# EAGLE design sport mode (EAGLE 9.6.1)
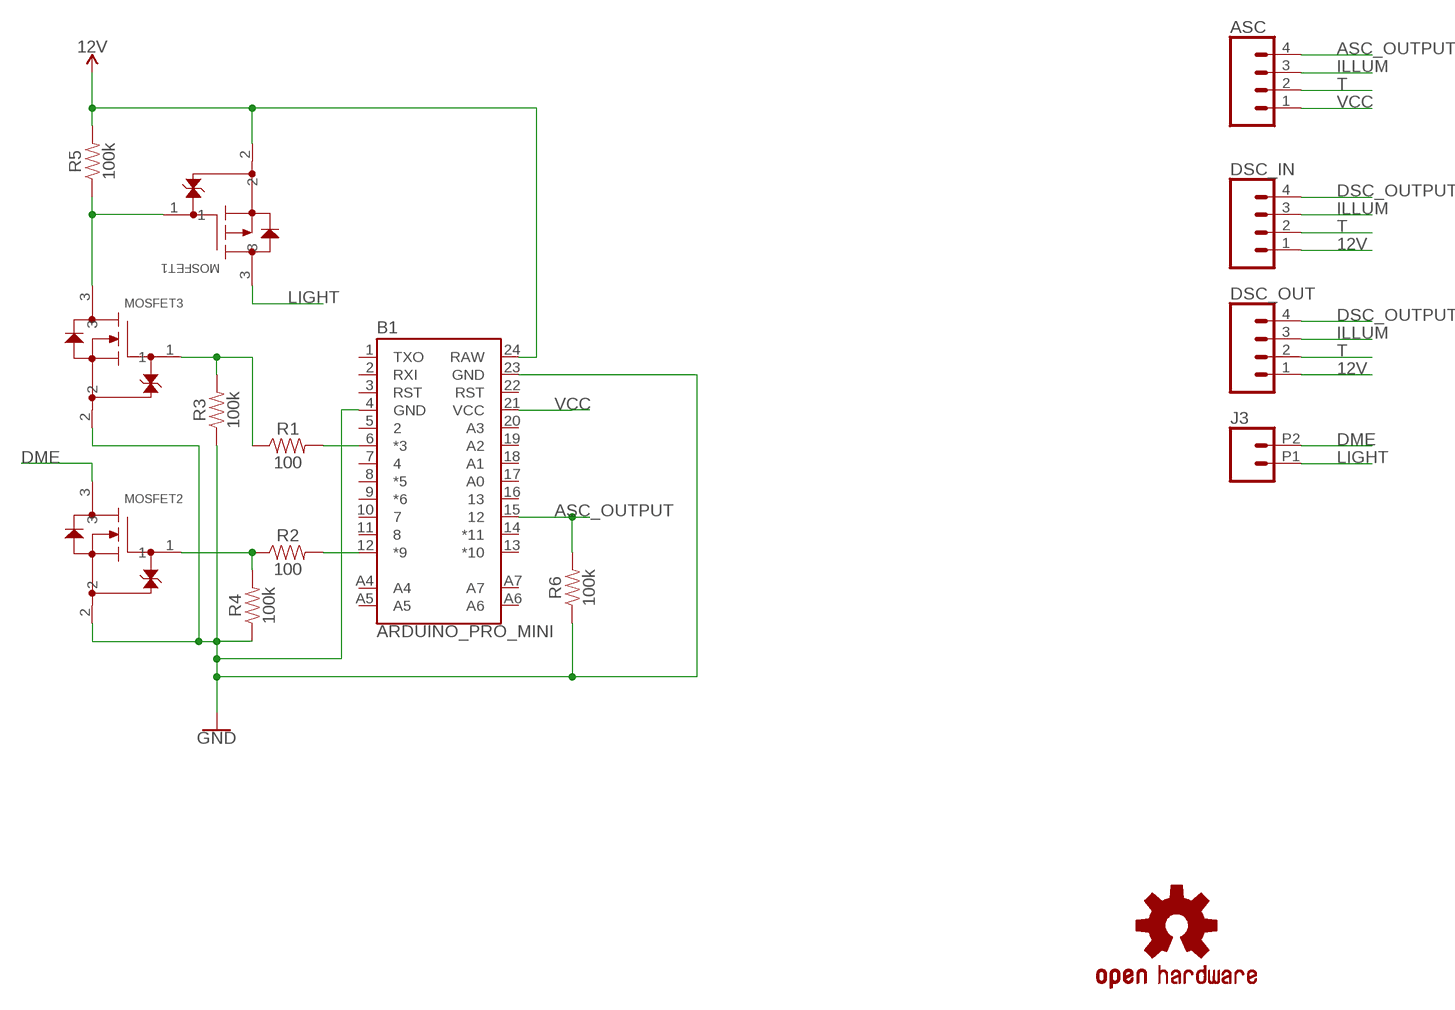
[diagram p0: schematic, sheet 1]

## Parts
ASC  CONN_04  [1X04]
B1  ARDUINO_PRO_MINI  [ARDUINO_PRO_MINI]
DSC_IN  CONN_04  [1X04]
DSC_OUT  CONN_04  [1X04]
J3  CONN_022.54MM_SCREWTERM  [1X02_2.54_SCREWTERM]
LOGO1  OSHW-LOGOL-COPPER  [OSHW-LOGO-L_COPPER]
MOSFET1  SSM3J328R  [SOT-23F]
MOSFET2  SSM3K329R  [SOT-23F]
MOSFET3  SSM3K329R  [SOT-23F]
R1  100  100OHM-0603-1/4W-5%  [0603]
R2  100  100OHM-0603-1/4W-5%  [0603]
R3  100k  100KOHM-0603-1/10W-1%  [0603]
R4  100k  100KOHM-0603-1/10W-1%  [0603]
R5  100k  100KOHM-0603-1/10W-1%  [0603]
R6  100k  100KOHM-0603-1/10W-1%  [0603]

## Nets
12V: B1.24(RAW) DSC_IN.1 DSC_OUT.1 MOSFET1.2 R5.2
ASC_OUTPUT: ASC.4 B1.15 R6.2
DME: J3.P2 MOSFET2.3
DSC_OUTPUT: DSC_IN.4 DSC_OUT.4
ILLUM: ASC.3 DSC_IN.3 DSC_OUT.3
LIGHT: J3.P1 MOSFET1.3
N$5: B1.12(*9) R2.2
N$6: B1.6(*3) R1.2
N$7: MOSFET2.1 R2.1 R4.2
N$8: MOSFET3.1 R1.1 R3.2
N$11: MOSFET1.1 MOSFET3.3 R5.1
T: ASC.2 B1.4(GND) B1.23(GND) DSC_IN.2 DSC_OUT.2 MOSFET2.2 MOSFET3.2 R3.1 R4.1 R6.1 ; supply symbol labelled GND
VCC: ASC.1 B1.21(VCC)
Unconnected: B1.1(TXO) B1.2(RXI) B1.3(RST) B1.5 B1.7 B1.8(*5) B1.9(*6) B1.10 B1.11 B1.13(*10) B1.14(*11) B1.16 B1.17(A0) B1.18(A1) B1.19(A2) B1.20(A3) B1.22(RST) B1.A4 B1.A5 B1.A6 B1.A7

## Library data of the parts
ASC DSC_IN DSC_OUT = SparkFun-Connectors:CONN_04: Multi connection point. Often used as Generic Header-pin footprint for 0.1 inch spaced/style header connections On any of the 0.1 inch spaced packages, you can populate with these: Break Away Headers - Straight <https://www.sparkfun.com/products/116> (PRT-00116) Break Away Male Headers - Right Angle <https://www.sparkfun.com/products/553> (PRT-00553) Female Headers <https://www.sparkfun.com/products/115> (PRT-00115) Break Away Headers - Machine Pin <https://www.sparkfun.com/products/117> (PRT-00117) Break Away Female Headers - Swiss Machine Pin <https://www.sparkfun.com/products/743> (PRT-00743) For SCREWTERMINALS and SPRING TERMINALS visit here: Screw Terimnals on SparkFun.com <https://www.sparkfun.com/search/results?term=Screw+Terminals> (5mm/3.5mm/2.54mm spacing) This device is also useful as a general connection point to wire up your design to another part of your project. Our various solder wires solder well into these plated through hole pads. Hook-Up Wire - Assortment (Stranded, 22 AWG) <https://www.sparkfun.com/products/11375> (PRT-11375) Hook-Up Wire - Assortment (Solid Core, 22 AWG) <https://www.sparkfun.com/products/11367> (PRT-11367) View the entire wire category on our website here <https://www.sparkfun.com/categories/141> Special notes: Molex polarized connector foot print use with SKU : PRT-08231 with associated crimp pins and housings. 1MM SMD Version SKU: PRT-10208; PROD_ID: CONN-09696
B1 = SparkFun-Boards:ARDUINO_PRO_MINI: SparkFun Pro Mini Pro Mini compatible footprint. Dimensions: 0.7 x 1.3" PCB Thickness: 0.8mm SparkFun Products: 3.3V/8MHz <https://www.sparkfun.com/products/11114> 5V/16MHz <https://www.sparkfun.com/products/11113>
J3 = SparkFun-Connectors:CONN_02: Multi connection point. Often used as Generic Header-pin footprint for 0.1 inch spaced/style header connections On any of the 0.1 inch spaced packages, you can populate with these: Break Away Headers - Straight <https://www.sparkfun.com/products/116> (PRT-00116) Break Away Male Headers - Right Angle <https://www.sparkfun.com/products/553> (PRT-00553) Female Headers <https://www.sparkfun.com/products/115> (PRT-00115) Break Away Headers - Machine Pin <https://www.sparkfun.com/products/117> (PRT-00117) Break Away Female Headers - Swiss Machine Pin <https://www.sparkfun.com/products/743> (PRT-00743) For SCREWTERMINALS and SPRING TERMINALS visit here: Screw Terimnals on SparkFun.com <https://www.sparkfun.com/search/results?term=Screw+Terminals> (5mm/3.5mm/2.54mm spacing) This device is also useful as a general connection point to wire up your design to another part of your project. Our various solder wires solder well into these plated through hole pads. Hook-Up Wire - Assortment (Stranded, 22 AWG) <https://www.sparkfun.com/products/11375> (PRT-11375) Hook-Up Wire - Assortment (Solid Core, 22 AWG) <https://www.sparkfun.com/products/11367> (PRT-11367) View the entire wire category on our website here <https://www.sparkfun.com/categories/141> Special notes: Molex polarized connector foot print use with: PRT-08233 with associated crimp pins and housings. 2.54_SCREWTERM for use with PRT-10571. 3.5mm Screw Terminal footprints for PRT-08084 5mm Screw Terminal footprints for use with PRT-08432
LOGO1 = SparkFun-Aesthetics:OSHW-LOGO: Open-Source Hardware (OSHW) Logo This logo indicates the piece of hardware it is found on incorporates a OSHW license and/or adheres to the definition of open source hardware found here: http://freedomdefined.org/OSHW
MOSFET1 = my libs:SSM3J328R; MANUFACTURER_PART_NUMBER: SSM3J328R; SOURCELIBRARY: Toshiba_2018-12-14; VENDOR: Toshiba
MOSFET2 MOSFET3 = my libs:SSM3K329R; MANUFACTURER_PART_NUMBER: SSM3K329R; SOURCELIBRARY: Toshiba_2018-12-14; VENDOR: Toshiba
R1 R2 = SparkFun-Resistors:100OHM: 100Ω resistor A resistor is a passive two-terminal electrical component that implements electrical resistance as a circuit element. Resistors act to reduce current flow, and, at the same time, act to lower voltage levels within circuits. - Wikipedia; PROD_ID: RES-12438
R3-R6 = SparkFun-Resistors:100KOHM: 100kΩ resistor A resistor is a passive two-terminal electrical component that implements electrical resistance as a circuit element. Resistors act to reduce current flow, and, at the same time, act to lower voltage levels within circuits. - Wikipedia; PROD_ID: RES-07828

## Board
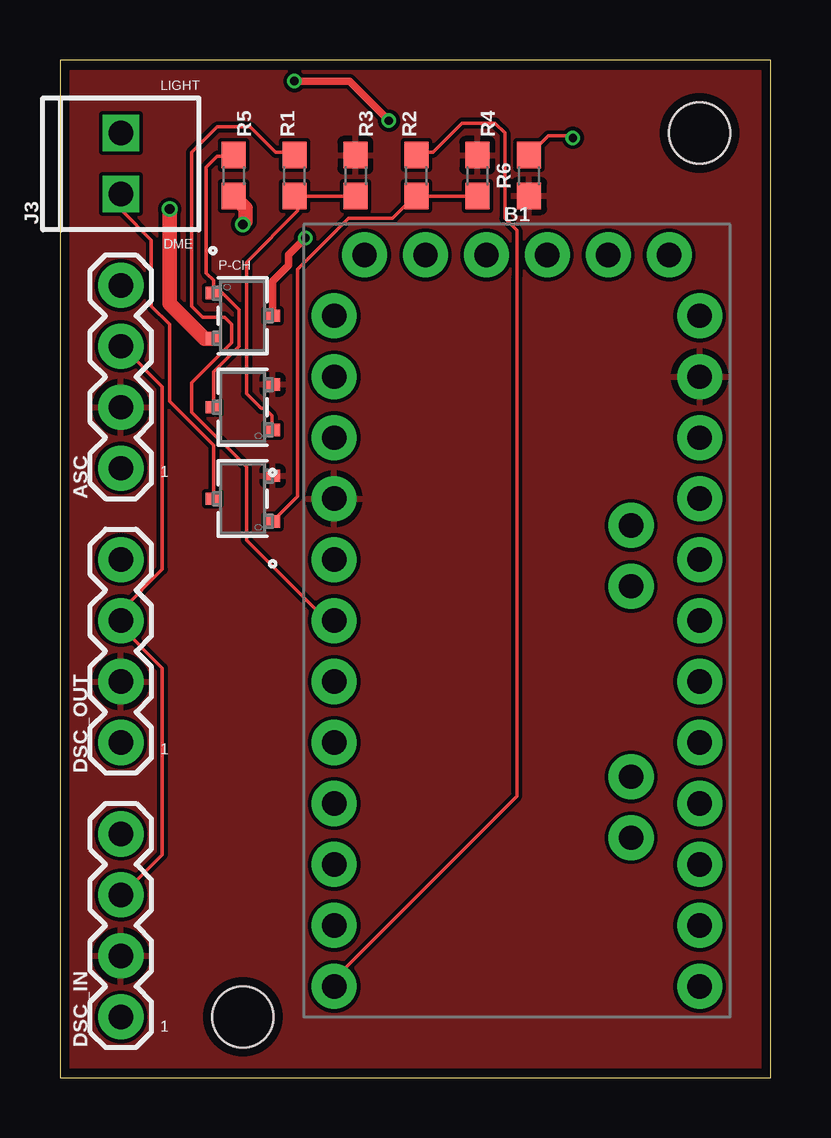
[diagram p1: board, top side]
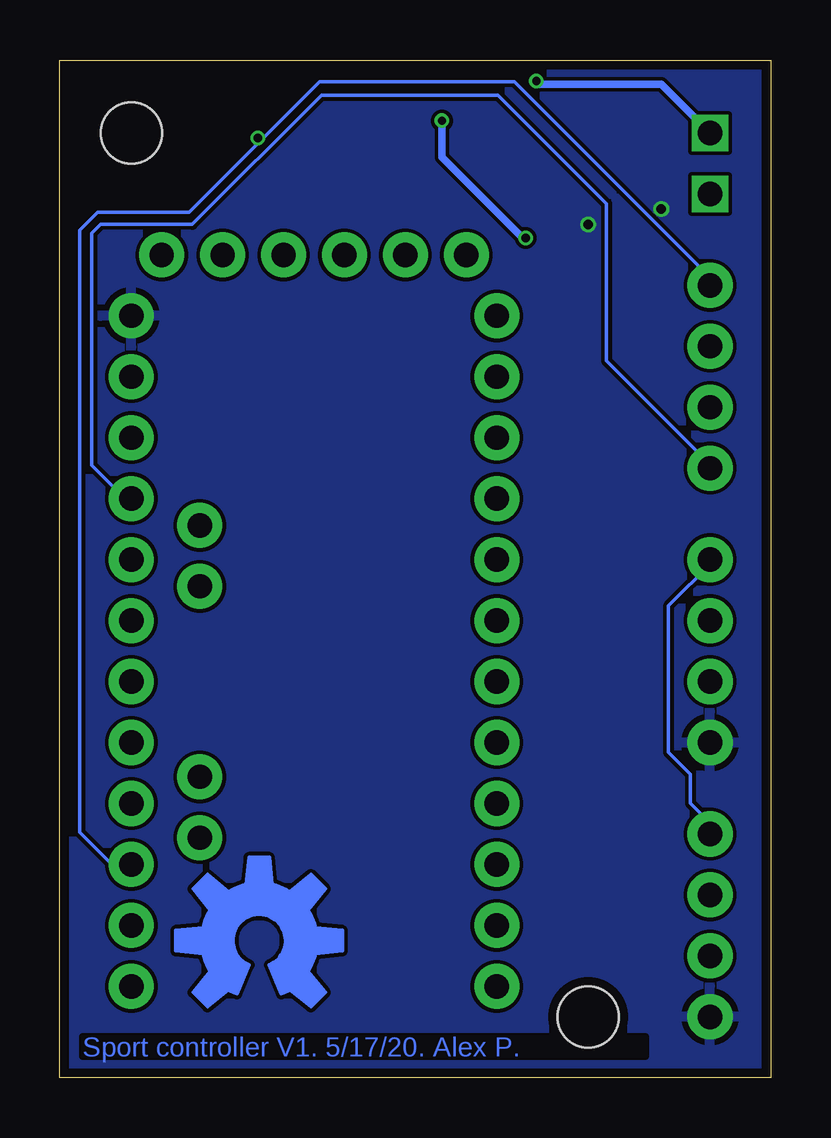
[diagram p2: board, bottom side, seen from below]

Size 29.64 x 42.41 mm. Coordinates in mm from the lower left corner, seen from the top.
Outline: 0,0 29.64,0 29.64,42.41 0,42.41 0,0
Copper layers (1*16): Top 0.035559375mm / dielectric 1.6mm / Bottom 0.035559375mm
Design rules "oshpark-2layer": minimum track width 6mil, minimum drill 10mil, track to track 6mil, track to pad 6mil, pad to pad 6mil, via to via 6mil, smd to smd 6mil, copper to edge 15mil, drill to drill 6mil, minimum pad ring 5mil, minimum via ring 5mil, stop-mask expansion 2.5mil, vias tented up to drill 0mil, thermal gap 10mil
Holes 2.54 mm at 26.67,39.37 7.62,2.54

### Footprints (pad centres in the part's own frame; a part is rotated, then mirrored left to right if it is on the bottom)
1X04 = drill 1.016 pad 1.88: 1 0,0; 2 2.54,0; 3 5.08,0; 4 7.62,0
ARDUINO_PRO_MINI = drill 1.016 pad 1.88: 1 -7.62,12.7; 2 -7.62,10.16; 3 -7.62,7.62; 4 -7.62,5.08; 5 -7.62,2.54; 6 -7.62,0; 7 -7.62,-2.54; 8 -7.62,-5.08; 9 -7.62,-7.62; 10 -7.62,-10.16; 11 -7.62,-12.7; 12 -7.62,-15.24; 13 7.62,-15.24; 14 7.62,-12.7; 15 7.62,-10.16; 16 7.62,-7.62; 17 7.62,-5.08; 18 7.62,-2.54; 19 7.62,0; 20 7.62,2.54; 21 7.62,5.08; 22 7.62,7.62; 23 7.62,10.16; 24 7.62,12.7; A4 4.763,1.429; A5 4.763,3.969; A6 4.763,-9.049; A7 4.763,-6.509; BLK -6.35,15.24; GND -3.81,15.24; GRN 6.35,15.24; RXI 1.27,15.24; TXO 3.81,15.24; VCC -1.27,15.24
1X02_2.54_SCREWTERM = drill 1.016 square: P1 2.54,0; P2 0,0
SOT-23F = smd 0.508 x 0.61: 1 -0.95,-1.245; 2 0.95,-1.245; 3 0,1.245
0603 = smd 1.1 x 1: 1 -0.85,0; 2 0.85,0

### Placement (x,y rotation side)
ASC  2.54,25.4 90 top
B1  19.05,19.05 0 top
DSC_IN  2.54,2.54 90 top
DSC_OUT  2.54,13.97 90 top
J3  2.54,36.83 90 top
LOGO1  21.34,5.71 0 bottom
MOSFET1  7.62,31.75 270 top
MOSFET2  7.62,24.13 90 top
MOSFET3  7.62,27.94 90 top
R1  9.78,37.59 90 top
R2  14.86,37.59 90 top
R3  12.32,37.59 270 top
R4  17.4,37.59 270 top
R5  7.24,37.59 270 top
R6  19.56,37.59 90 top

### Tracks (layer width: path | path; a pad name or v marks a point on that pad's centre or on a via)
12V  (via drill 0.4)
  Top 0.61: R5.2 7.75,36.23 7.75,35.69 v7.62,35.56 | MOSFET1.2 6.03,30.8 4.57,32.26 v4.57,36.2
  pour Bottom: 0,0 0,41.91 29.21,41.91 29.21,0
ASC_OUTPUT  (via drill 0.35)
  Top 0.152: R6.2 20.36,39.24 21.3,39.24 v21.38,39.16
  Bottom 0.152: 21.38,38.94 18.82,41.5 10.69,41.5 2.59,33.4 2.59,33.07 ASC.4 | 21.38,38.94 24.26,36.07 28.07,36.07 28.83,35.31 28.83,10.24 27.58,8.99 26.67,8.99 B1.15 | v21.38,39.16 21.38,38.94
DME
  Top 0.152: MOSFET2.3 6.4,24.23 6.4,26.36 4.57,28.19 4.57,31.39 3.81,32.16 3.81,34.9 2.59,36.12 2.59,36.73 J3.P2
DSC_OUTPUT
  Bottom 0.152: DSC_IN.4 2.59,10.21 2.59,10.67 3.35,11.43 3.35,12.65 4.27,13.56 4.27,19.66 2.44,21.49 DSC_OUT.4
ILLUM
  Top 0.152: 2.59,19.05 2.59,18.75 4.27,17.07 4.27,9.3 2.59,7.62 DSC_IN.3 | 2.59,19.05 2.59,19.51 4.27,21.18 4.27,28.8 2.59,30.48 ASC.3 | 2.59,19.05 DSC_OUT.3
LIGHT  (via drill 0.35)
  Top 0.305: v9.78,41.53 12.06,41.53 v13.72,39.88 | v10.22,34.99 9.52,34.29 9.52,33.85 8.87,33.2 MOSFET1.3
  Bottom 0.305: J3.P1 4.57,41.4 9.78,41.4 v9.78,41.53 | v13.72,39.88 13.72,38.35 10.29,34.92 v10.22,34.99
N$5
  Top 0.152: B1.12 11.43,4.12 19.05,11.73 19.05,33.02 19.05,33.38 19.05,35.31 18.54,35.81 18.54,39.37 18.14,39.78 16.76,39.78 15.54,38.56 14.94,38.56 R2.2
N$6
  Top 0.152: B1.6 11.12,19.05 7.77,22.4 7.77,25.45 5.49,27.74 5.49,28.96 7.16,30.63 7.16,31.39 6.86,31.7 5.94,31.7 5.49,32.16 5.49,38.56 6.55,39.62 7.92,39.62 8.99,38.56 9.75,38.56 R1.2
N$7
  Top 0.152: 8.84,23.32 MOSFET2.1 9.91,24.22 9.91,33.68 12.04,35.81 13.87,35.81 14.78,36.73 R2.1 14.94,36.73 17.37,36.73 R4.2
N$8
  Top 0.152: 9.91,36.73 9.91,36.12 7.77,33.98 7.77,28.5 8.38,27.89 8.53,27.89 8.84,27.58 8.84,27.13 MOSFET3.1 | 9.91,36.73 12.19,36.73 R3.2 | 9.91,36.73 R1.1
N$11
  Top 0.152: 6.4,32.77 6.71,32.77 7.47,32 7.47,30.48 6.4,29.41 6.4,28.04 MOSFET3.3 | 6.4,32.77 6.4,33.22 6.1,33.53 6.1,37.95 6.55,38.41 7.16,38.41 R5.1 | 6.4,32.77 MOSFET1.1
T
  pour Top: 0,0 0,41.91 29.21,41.91 29.21,0
VCC
  Bottom 0.152: ASC.1 3.05,25.91 3.05,26.06 6.86,29.87 6.86,36.42 11.38,40.95 18.75,40.95 24.13,35.56 27.94,35.56 28.32,35.18 28.32,25.53 27.03,24.23 26.67,24.23 B1.21

### Text on the board
Bottom: Sport controller V1. 5/17/20. Alex P.
tPlace: P-CH
tNames: LIGHT | DME | 1 | 1 | 1